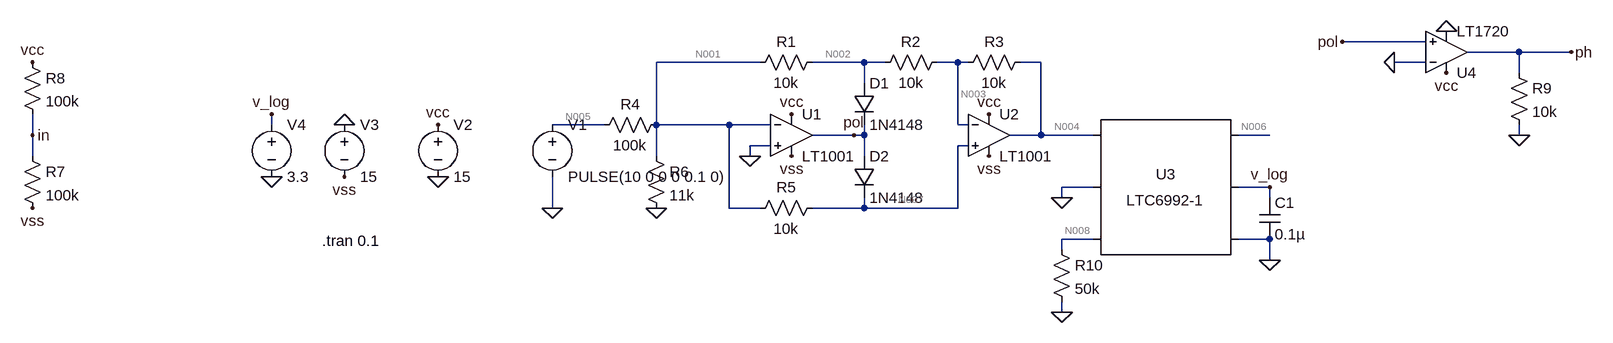
[diagram p0: schematic Draft2.asc]
Draft2.asc, the LTspice schematic file:
Version 4
SHEET 1 1312 680
WIRE 1040 16 912 16
WIRE 1184 32 1104 32
WIRE 1264 32 1184 32
WIRE 16 48 -144 48
WIRE 176 48 96 48
WIRE 208 48 176 48
WIRE 320 48 288 48
WIRE 336 48 320 48
WIRE 448 48 416 48
WIRE 1040 48 992 48
WIRE 1184 64 1184 32
WIRE 176 80 176 48
WIRE -736 144 -736 128
WIRE -224 144 -304 144
WIRE -144 144 -144 48
WIRE -32 144 -144 144
WIRE 32 144 -32 144
WIRE 320 144 320 48
WIRE 336 144 320 144
WIRE -1104 160 -1104 128
WIRE 160 160 96 160
WIRE 176 160 176 144
WIRE 176 160 160 160
WIRE 448 160 448 48
WIRE 448 160 400 160
WIRE 528 160 448 160
WIRE 800 160 752 160
WIRE 1184 160 1184 144
WIRE 32 176 0 176
WIRE 336 176 320 176
WIRE -1104 192 -1104 160
WIRE -144 192 -144 144
WIRE 0 192 0 176
WIRE 176 192 176 160
WIRE 528 240 480 240
WIRE 800 240 752 240
WIRE 480 256 480 240
WIRE 800 256 800 240
WIRE -304 272 -304 224
WIRE -32 272 -32 144
WIRE 16 272 -32 272
WIRE 176 272 176 256
WIRE 176 272 96 272
WIRE 320 272 320 176
WIRE 320 272 176 272
WIRE 528 320 480 320
WIRE 800 320 800 304
WIRE 800 320 752 320
WIRE 480 336 480 320
WIRE 800 352 800 320
WIRE 480 432 480 416
FLAG 0 192 0
FLAG -144 272 0
FLAG -304 272 0
FLAG -480 224 0
FLAG -624 144 0
FLAG -480 144 vcc
FLAG -624 224 vss
FLAG 64 192 vss
FLAG 368 192 vss
FLAG 64 128 vcc
FLAG 368 128 vcc
FLAG -1104 272 vss
FLAG -1104 48 vcc
FLAG -1104 160 in
FLAG 160 160 pol
FLAG 912 16 pol
FLAG 1072 64 vcc
FLAG 1072 0 0
FLAG 992 48 0
FLAG 1264 32 ph
FLAG 1184 160 0
FLAG 480 256 0
FLAG 480 432 0
FLAG -736 224 0
FLAG -736 128 v_log
FLAG 800 240 v_log
FLAG 800 352 0
SYMBOL Opamps\\LT1001 64 96 R0
SYMATTR InstName U1
SYMBOL Opamps\\LT1001 368 96 R0
SYMATTR InstName U2
SYMBOL res 112 32 R90
WINDOW 0 0 56 VBottom 2
WINDOW 3 32 56 VTop 2
SYMATTR InstName R1
SYMATTR Value 10k
SYMBOL res 304 32 R90
WINDOW 0 0 56 VBottom 2
WINDOW 3 32 56 VTop 2
SYMATTR InstName R2
SYMATTR Value 10k
SYMBOL res 432 32 R90
WINDOW 0 0 56 VBottom 2
WINDOW 3 32 56 VTop 2
SYMATTR InstName R3
SYMATTR Value 10k
SYMBOL res -128 128 R90
WINDOW 0 0 56 VBottom 2
WINDOW 3 32 56 VTop 2
SYMATTR InstName R4
SYMATTR Value 100k
SYMBOL res 112 256 R90
WINDOW 0 0 56 VBottom 2
WINDOW 3 32 56 VTop 2
SYMATTR InstName R5
SYMATTR Value 10k
SYMBOL diode 160 80 R0
SYMATTR InstName D1
SYMATTR Value 1N4148
SYMBOL diode 160 192 R0
SYMATTR InstName D2
SYMATTR Value 1N4148
SYMBOL res -160 176 R0
SYMATTR InstName R6
SYMATTR Value 11k
SYMBOL voltage -304 128 R0
WINDOW 123 0 0 Left 0
WINDOW 39 0 0 Left 0
SYMATTR InstName V1
SYMATTR Value PULSE(10 0 0 0 0.1 0)
SYMBOL voltage -480 128 R0
WINDOW 123 0 0 Left 0
WINDOW 39 0 0 Left 0
SYMATTR InstName V2
SYMATTR Value 15
SYMBOL voltage -624 128 R0
WINDOW 123 0 0 Left 0
WINDOW 39 0 0 Left 0
SYMATTR InstName V3
SYMATTR Value 15
SYMBOL res -1120 176 R0
SYMATTR InstName R7
SYMATTR Value 100k
SYMBOL res -1120 32 R0
SYMATTR InstName R8
SYMATTR Value 100k
SYMBOL res 1168 48 R0
SYMATTR InstName R9
SYMATTR Value 10k
SYMBOL Comparators\\LT1720 1072 96 M180
SYMATTR InstName U4
SYMBOL SpecialFunctions\\LTC6992-1 640 240 R0
SYMATTR InstName U3
SYMBOL res 464 320 R0
SYMATTR InstName R10
SYMATTR Value 50k
SYMBOL cap 784 256 R0
SYMATTR InstName C1
SYMATTR Value 0.1µ
SYMBOL voltage -736 128 R0
WINDOW 123 0 0 Left 0
WINDOW 39 0 0 Left 0
SYMATTR InstName V4
SYMATTR Value 3.3
TEXT -658 322 Left 2 !.tran 0.1

The netlist it stands for:
* Draft2.asc
XU1 0 N001 vcc vss pol LT1001  ; pins In+ In- V+ V- OUT
XU2 N007 N003 vcc vss N004 LT1001  ; pins In+ In- V+ V- OUT
R1 N002 N001 10k
R2 N003 N002 10k
R3 N004 N003 10k
R4 N001 N005 100k
R5 N007 N001 10k
D1 N002 pol 1N4148
D2 pol N007 1N4148
R6 N001 0 11k
V1 N005 0 PULSE(10 0 0 0 0.1 0)
V2 vcc 0 15
V3 0 vss 15
R7 in vss 100k
R8 vcc in 100k
R9 ph 0 10k
XU4 pol 0 vcc 0 ph LT1720  ; pins In+ In- V+ V- OUT
XU3 N004 0 N008 0 v_log N006 LTC6992-1
R10 N008 0 50k
C1 v_log 0 0.1µ
V4 v_log 0 3.3
.model D D
.lib standard.dio
.tran 0.1
.lib LTC.lib
.lib LT1720.sub
.lib LTC6992-1.sub
.backanno
.end

* Results of the author's LTspice run, read from the files saved beside the schematic
* Operating Point, zero values left out:
*   V(n001) = 2.034 µV
*   V(vcc) = 15 V
*   V(vss) = -15 V
*   V(pol) = -1.511 V
*   V(n003) = -24.53 µV
*   V(n007) = -23.18 µV
*   V(n004) = 999.9 mV
*   V(n002) = -1 V
*   V(n005) = 10 V
*   V(ph) = 168.3 mV
*   V(n006) = 71.94 nV
*   V(v_log) = 3.3 V
*   V(n008) = 1 V
*   I(D2) = -2.522 nA
*   I(D1) = 200 µA
*   I(R10) = 20 µA
*   I(R9) = 16.83 µA
*   I(R8) = 150 µA
*   I(R7) = 150 µA
*   I(R6) = 184.9 pA
*   I(R5) = -2.522 nA
*   I(R4) = -100 µA
*   I(R3) = 99.99 µA
*   I(R2) = 99.99 µA
*   I(R1) = -100 µA
*   I(V4) = -152.3 µA
*   I(V3) = -4.704 mA
*   I(V2) = -13.61 mA
*   I(V1) = -100 µA